# Altium project Tigershark 3D rev2 PreProduction Thermistors Version.PrjPcb (part 2 of 2)
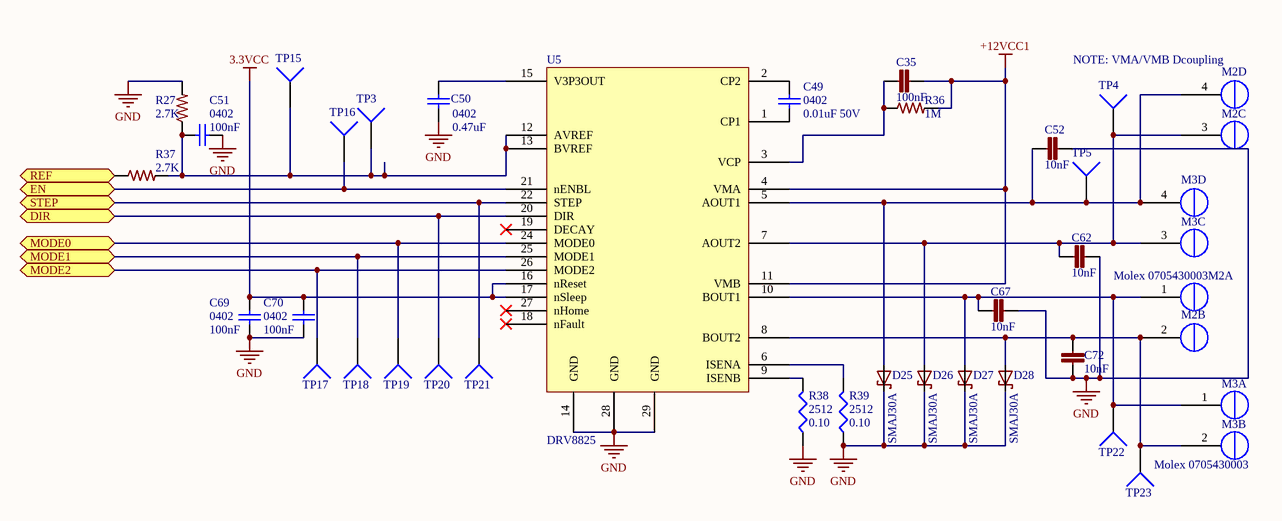
[diagram p8: MZ.SchDoc]

## Nets that join several sheets
3.3VCC: ATSAM3X8E Main Controller - TR R1.1 (37 pins), TR1 (R19_TR1.2), TR2 (R19_TR2.2), TR3 (R19_TR3.2), TR4 (R19_TR4.2), Power (5 pins), ES1 (MAX1_ES1.3 MIN1_ES1.3 R2_ES1.2 R3_ES1.2), ES2 (MAX1_ES2.3 MIN1_ES2.3 R2_ES2.2 R3_ES2.2), ES3 (MAX1_ES3.3 MIN1_ES3.3 R2_ES3.2 R3_ES3.2), M1 (C12_M1.2 C14_M1.2 U7_M1.16 U7_M1.17), M2 (C12_M2.2 C14_M2.2 U7_M2.16 U7_M2.17), M3 (C12_M3.2 C14_M3.2 U7_M3.16 U7_M3.17), M4 (C12_M4.2 C14_M4.2 U7_M4.16 U7_M4.17), MOSFETs and Driver (C25.2 C26.2 U8.2 U8.8), MZ (C69.2 C70.2 U5.16 U5.17)
+5VCC: ATSAM3X8E Main Controller - TR R1.1 (C29.2 P4.10), Power (9 pins), MOSFETs and Driver (C17.2 C20.2 U8.15)
+12VCC1: Power (8 pins), M1 (C66_M1.2 R30_M1.2 U7_M1.4 U7_M1.11), M2 (C66_M2.2 R30_M2.2 U7_M2.4 U7_M2.11), M3 (C66_M3.2 R30_M3.2 U7_M3.4 U7_M3.11), M4 (C66_M4.2 R30_M4.2 U7_M4.4 U7_M4.11), MZ (C35.2 R36.2 U5.4 U5.11)
+12VCC2: Power (11 pins), MOSFETs and Driver (13 pins)
+12VCC3: Power (C15.1 D4.C F2.2 TP49.1), MOSFETs and Driver (D19.2 R68.2 T1.9)
FGND: ATSAM3X8E Main Controller - TR R1.1 (D8.C D9.C S1.3 S1.4), Power (5 pins)
GND: ATSAM3X8E Main Controller - TR R1.1 (64 pins), TR1 (C30_TR1.2 D5_TR1.A P2_TR1.2), TR2 (C30_TR2.2 D5_TR2.A P2_TR2.2), TR3 (C30_TR3.2 D5_TR3.A P2_TR3.2), TR4 (C30_TR4.2 D5_TR4.A P2_TR4.2), Power (32 pins), ES1 (C1_ES1.1 C2_ES1.1 MAX1_ES1.2 MIN1_ES1.2), ES2 (C1_ES2.1 C2_ES2.1 MAX1_ES2.2 MIN1_ES2.2), ES3 (C1_ES3.1 C2_ES3.1 MAX1_ES3.2 MIN1_ES3.2), M1 (18 pins), M2 (18 pins), M3 (18 pins), M4 (18 pins), MOSFETs and Driver (25 pins), MZ (18 pins)
BED_PWM: ATSAM3X8E Main Controller - TR R1.1 (U3.132), MOSFETs and Driver (R71.2 TP38.1 U8.7)
DIR1: ATSAM3X8E Main Controller - TR R1.1 (U3.87), M1 (TP39_M1.1 U7_M1.20)
DIR2: ATSAM3X8E Main Controller - TR R1.1 (U3.93), M2 (TP39_M2.1 U7_M2.20)
DIR3: ATSAM3X8E Main Controller - TR R1.1 (U3.116), M3 (TP39_M3.1 U7_M3.20)
DIR4: ATSAM3X8E Main Controller - TR R1.1 (U3.123), M4 (TP39_M4.1 U7_M4.20)
DIR_Z: ATSAM3X8E Main Controller - TR R1.1 (U3.99), MZ (TP20.1 U5.20)
EN1: ATSAM3X8E Main Controller - TR R1.1 (U3.86), M1 (TP32_M1.1 U7_M1.21)
EN2: ATSAM3X8E Main Controller - TR R1.1 (U3.92), M2 (TP32_M2.1 U7_M2.21)
EN3: ATSAM3X8E Main Controller - TR R1.1 (U3.115), M3 (TP32_M3.1 U7_M3.21)
EN4: ATSAM3X8E Main Controller - TR R1.1 (U3.122), M4 (TP32_M4.1 U7_M4.21)
EN_Z: ATSAM3X8E Main Controller - TR R1.1 (U3.98), MZ (TP16.1 U5.21)
FET_PWM1: ATSAM3X8E Main Controller - TR R1.1 (U3.60), MOSFETs and Driver (R46.2 TP43.1 U8.1)
FET_PWM2: ATSAM3X8E Main Controller - TR R1.1 (U3.63), MOSFETs and Driver (R55.2 TP44.1 U8.3)
FET_PWM3: ATSAM3X8E Main Controller - TR R1.1 (U3.65), MOSFETs and Driver (R59.2 TP45.1 U8.4)
FET_PWM4: ATSAM3X8E Main Controller - TR R1.1 (U3.67), MOSFETs and Driver (R63.2 TP46.1 U8.5)
FET_PWM5: ATSAM3X8E Main Controller - TR R1.1 (U3.133), MOSFETs and Driver (R67.2 TP47.1 U8.6)
MAX_ES1: ATSAM3X8E Main Controller - TR R1.1 (DA1.2 U3.76), ES1 (C2_ES1.2 MAX1_ES1.1 R3_ES1.1 TP10_ES1.1)
MAX_ES2: ATSAM3X8E Main Controller - TR R1.1 (DA2.2 U3.22), ES2 (C2_ES2.2 MAX1_ES2.1 R3_ES2.1 TP10_ES2.1)
MAX_ES3: ATSAM3X8E Main Controller - TR R1.1 (DA3.2 U3.78), ES3 (C2_ES3.2 MAX1_ES3.1 R3_ES3.1 TP10_ES3.1)
MIN_ES1: ATSAM3X8E Main Controller - TR R1.1 (DA1.1 U3.77), ES1 (C1_ES1.2 MIN1_ES1.1 R2_ES1.1 TP9_ES1.1)
MIN_ES2: ATSAM3X8E Main Controller - TR R1.1 (DA2.1 U3.19), ES2 (C1_ES2.2 MIN1_ES2.1 R2_ES2.1 TP9_ES2.1)
MIN_ES3: ATSAM3X8E Main Controller - TR R1.1 (DA3.1 U3.100), ES3 (C1_ES3.2 MIN1_ES3.1 R2_ES3.1 TP9_ES3.1)
MOD0E1: ATSAM3X8E Main Controller - TR R1.1 (U3.84), M1 (TP37_M1.1 U7_M1.24)
MOD0E2: ATSAM3X8E Main Controller - TR R1.1 (U3.135), M2 (TP37_M2.1 U7_M2.24)
MOD0E3: ATSAM3X8E Main Controller - TR R1.1 (U3.113), M3 (TP37_M3.1 U7_M3.24)
MOD0E4: ATSAM3X8E Main Controller - TR R1.1 (U3.120), M4 (TP37_M4.1 U7_M4.24)
MOD0E_Z: ATSAM3X8E Main Controller - TR R1.1 (U3.96), MZ (TP19.1 U5.24)
MOD1E1: ATSAM3X8E Main Controller - TR R1.1 (U3.83), M1 (TP36_M1.1 U7_M1.25)
MOD1E2: ATSAM3X8E Main Controller - TR R1.1 (U3.140), M2 (TP36_M2.1 U7_M2.25)
MOD1E3: ATSAM3X8E Main Controller - TR R1.1 (U3.117), M3 (TP36_M3.1 U7_M3.25)
MOD1E4: ATSAM3X8E Main Controller - TR R1.1 (U3.119), M4 (TP36_M4.1 U7_M4.25)
MOD1E_Z: ATSAM3X8E Main Controller - TR R1.1 (U3.95), MZ (TP18.1 U5.25)
MOD2E1: ATSAM3X8E Main Controller - TR R1.1 (U3.82), M1 (TP35_M1.1 U7_M1.26)
MOD2E2: ATSAM3X8E Main Controller - TR R1.1 (U3.141), M2 (TP35_M2.1 U7_M2.26)
MOD2E3: ATSAM3X8E Main Controller - TR R1.1 (U3.131), M3 (TP35_M3.1 U7_M3.26)
MOD2E4: ATSAM3X8E Main Controller - TR R1.1 (U3.118), M4 (TP35_M4.1 U7_M4.26)
MOD2E_Z: ATSAM3X8E Main Controller - TR R1.1 (U3.94), MZ (TP17.1 U5.26)
OVREF: TR1 (D3_TR1.C), TR2 (D3_TR2.C), TR3 (D3_TR3.C), TR4 (D3_TR4.C), Power (D1.2 R1.1 TP2.1)
REF1: ATSAM3X8E Main Controller - TR R1.1 (U3.139), M1 (R31_M1.1)
REF2: ATSAM3X8E Main Controller - TR R1.1 (U3.102), M2 (R31_M2.1)
REF3: ATSAM3X8E Main Controller - TR R1.1 (U3.136), M3 (R31_M3.1)
REF4: ATSAM3X8E Main Controller - TR R1.1 (U3.137), M4 (R31_M4.1)
REF_Z: ATSAM3X8E Main Controller - TR R1.1 (U3.144), MZ (R37.1)
STEP1: ATSAM3X8E Main Controller - TR R1.1 (U3.85), M1 (TP40_M1.1 U7_M1.22)
STEP2: ATSAM3X8E Main Controller - TR R1.1 (U3.134), M2 (TP40_M2.1 U7_M2.22)
STEP3: ATSAM3X8E Main Controller - TR R1.1 (U3.114), M3 (TP40_M3.1 U7_M3.22)
STEP4: ATSAM3X8E Main Controller - TR R1.1 (U3.121), M4 (TP40_M4.1 U7_M4.22)
STEP_Z: ATSAM3X8E Main Controller - TR R1.1 (U3.97), MZ (TP21.1 U5.22)
THERM_AN1: ATSAM3X8E Main Controller - TR R1.1 (U3.88), TR1 (5 pins)
THERM_AN2: ATSAM3X8E Main Controller - TR R1.1 (U3.89), TR2 (5 pins)
THERM_AN3: ATSAM3X8E Main Controller - TR R1.1 (U3.90), TR3 (5 pins)
THERM_AN4: ATSAM3X8E Main Controller - TR R1.1 (U3.91), TR4 (5 pins)